# EAGLE design Laser head board (EAGLE 9.6.2)
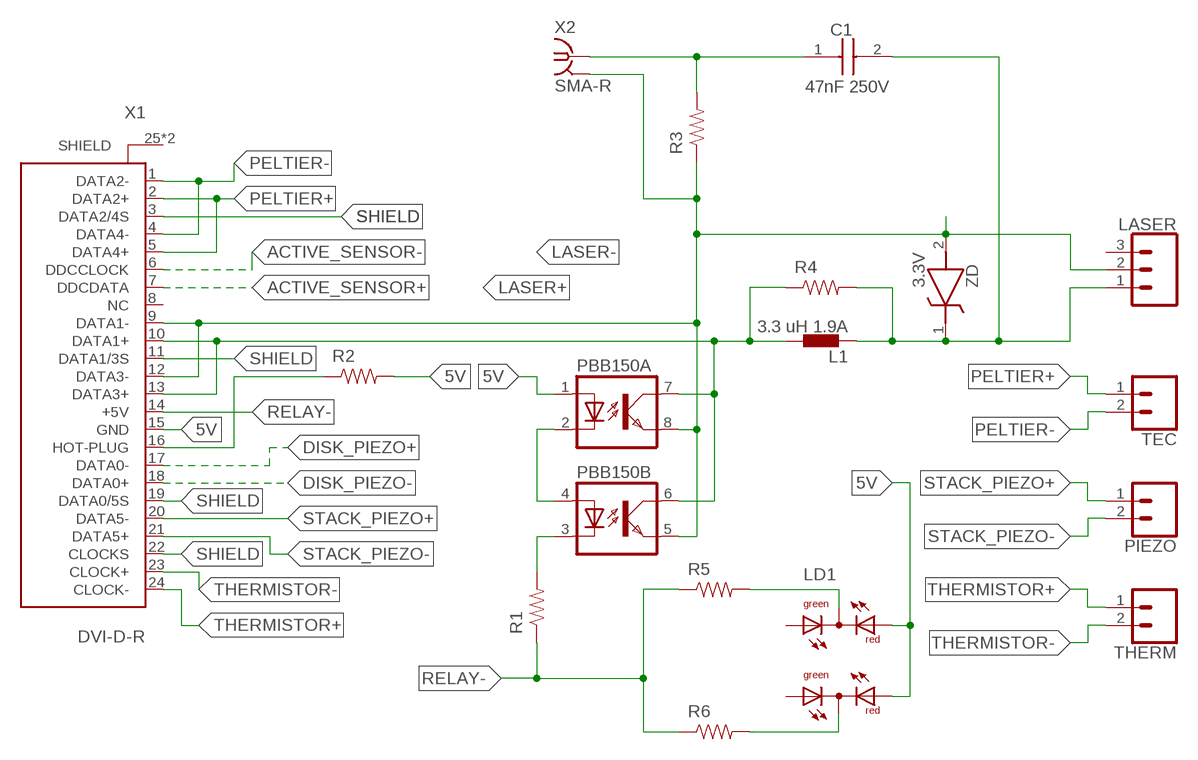
[diagram p0: schematic, sheet 1]

## Parts
C1  47nF 250V  OCR_C3216X7R2E473K160AA  [OCR_CAPC3216X180N]
L1  3.3 uH 1.9A  OCR_SLF7032T  [OCR_INDC7070]
LASER  OCR_CONN_03  [OCR_MOLEX-1X3_LOCK]
LD1  OCR_WP130WCP/2EGW  [OCR_WP130WCP/2EGW]
PBB150  OCR_PBB150  [OCR_DIL08]
PIEZO  OCR_CONN_02  [OCR_MOLEX-1X2_LOCK]
R1  390R  OCR_RESISTOR  [OCR_0805]
R2  4k99  OCR_RESISTOR  [OCR_0805]
R3  10k  OCR_RESISTOR  [OCR_0805]
R4  43R  OCR_RESISTOR  [OCR_0805]
R5  499R  OCR_RESISTOR  [OCR_0805]
R6  499R  OCR_RESISTOR  [OCR_0805]
TEC  OCR_CONN_02  [OCR_MOLEX-1X2_LOCK]
THERM  OCR_CONN_02  [OCR_MOLEX-1X2_LOCK]
X1  DVI-D-R  OCR_DVI-D-R_74320  [OCR_DVI-D-R]
X2  SMA-R  OCR_SMA-R/A  [OCR_SMA_0732512201]
ZD  3.3V  OCR_MMSZ3V3T1G  [OCR_SOD3716X135N]

## Nets
5V: LD1.R1 LD1.R2 PBB150.1(A:A) R2.2 X1.15(GND)
ACTIVE_SENSOR+: X1.7(DDCDATA)
ACTIVE_SENSOR-: X1.6(DDCCLOCK)
DISK_PIEZO+: X1.17(DATA0-)
DISK_PIEZO-: X1.18(DATA0+)
INTERLOCK+: R2.1 X1.16(HOT-PLUG)
LASER+: L1.2 PBB150.6(B:COL) PBB150.7(A:COL) R4.1 X1.10(DATA1+) X1.13(DATA3+)
LASER-: LASER.2 PBB150.5(B:EMIT) PBB150.8(A:EMIT) R3.1 X1.9(DATA1-) X1.12(DATA3-) X2.2 X2.3 X2.4 X2.5 ZD.2(A)
N$1: LD1.GND1 R5.2
N$2: C1.1 R3.2 X2.1
N$3: LD1.GND2 R6.2
N$7: PBB150.2(A:C) PBB150.4(B:A)
N$8: PBB150.3(B:C) R1.2
N$10: C1.2 L1.1 LASER.1 R4.2 ZD.1(K)
PELTIER+: TEC.1 X1.2(DATA2+) X1.5(DATA4+)
PELTIER-: TEC.2 X1.1(DATA2-) X1.4(DATA4-)
RELAY-: R1.1 R5.1 R6.1 X1.14(+5V)
SHIELD: X1.3(DATA2/4S) X1.11(DATA1/3S) X1.19(DATA0/5S) X1.22(CLOCKS)
STACK_PIEZO+: PIEZO.1 X1.20(DATA5-)
STACK_PIEZO-: PIEZO.2 X1.21(DATA5+)
THERMISTOR+: THERM.1 X1.24(CLOCK-)
THERMISTOR-: THERM.2 X1.23(CLOCK+)
Unconnected: LASER.3 LD1.G1 LD1.G2 X1.8(NC)

## Power pins joined to a net without a drawn wire
SHIELD: X1.25(SHIELD) X1.26(SHIELD)

## Library data of the parts
C1 = headboard:OCR_C3216X7R2E473K160AA: TDK C3216 C 47nF Ceramic Multilayer Capacitor, 250 V dc, +125C, X7R Dielectric, 10% SMD Source: Datasheet <https://componentsearchengine.com/Datasheets/1/C3216X7R2E473K160AA.pdf>; DESCRIPTION: TDK C3216 C 47nF Ceramic Multilayer Capacitor, 250 V dc, +125C, X7R Dielectric, 10% SMD; HEIGHT: 1.8mm; MANUFACTURER_NAME: TDK; MANUFACTURER_PART_NUMBER: C3216X7R2E473K160AA; MOUSER_PART_NUMBER: 810-C3216X7R2E473K
L1 = headboard:OCR_SLF7032T: Fixed Inductors 100uH 0.6A; AVAILABILITY: Good; DESCRIPTION: Inductor Power Shielded Wirewound 100uH 20% 100KHz Ferrite 650mA 300mOhm DCR T/R; MF: TDK; MP: SLF7045T-101MR50-PF; PACKAGE: Nonstandard TDK; PRICE: 0.56 USD
LASER = headboard:OCR_CONN_03: Multi connection point. Often used as Generic Header-pin footprint for 0.1 inch spaced/style header connections On any of the 0.1 inch spaced packages, you can populate with these: Break Away Headers - Straight <https://www.sparkfun.com/products/116> (PRT-00116) Break Away Male Headers - Right Angle <https://www.sparkfun.com/products/553> (PRT-00553) Female Headers <https://www.sparkfun.com/products/115> (PRT-00115) Break Away Headers - Machine Pin <https://www.sparkfun.com/products/117> (PRT-00117) Break Away Female Headers - Swiss Machine Pin <https://www.sparkfun.com/products/743> (PRT-00743) Stackable Header - 3 Pin (Female, 0.1") <https://www.sparkfun.com/products/13875> (PRT-13875) For SCREWTERMINALS and SPRING TERMINALS visit here: Screw Terimnals on SparkFun.com <https://www.sparkfun.com/search/results?term=Screw+Terminals> (5mm/3.5mm/2.54mm spacing) This device is also useful as a general connection point to wire up your design to another part of your project. Our various solder wires solder well into these plated through hole pads. Hook-Up Wire - Assortment (Stranded, 22 AWG) <https://www.sparkfun.com/products/11375> (PRT-11375) Hook-Up Wire - Assortment (Solid Core, 22 AWG) <https://www.sparkfun.com/products/11367> (PRT-11367) View the entire wire category on our website here <https://www.sparkfun.com/categories/141> Special notes: Molex polarized connector foot print use with SKU : PRT-08232 with associated crimp pins and housings.
LD1 = headboard:OCR_WP130WCP/2EGW: Kingbright LED Two LED, 2 colors (red/green), 5 mm, round, common Cathode
PBB150 = headboard:OCR_PBB150: Mfr: IXYS Integrated Circuits Mouser <https://www.mouser.mx/ProductDetail/IXYS-Integrated-Circuits/PBB150?qs=sGAEpiMZZMsUriz2CNI3E0bxyj4gwKaXLjsKBQE3348=> Digikey <https://www.digikey.com.mx/product-detail/es/ixys-integrated-circuits-division/PBB150/CLA191-ND/565936>
PIEZO TEC THERM = headboard:OCR_CONN_02: Multi connection point. Often used as Generic Header-pin footprint for 0.1 inch spaced/style header connections On any of the 0.1 inch spaced packages, you can populate with these: Break Away Headers - Straight <https://www.sparkfun.com/products/116> (PRT-00116) Break Away Male Headers - Right Angle <https://www.sparkfun.com/products/553> (PRT-00553) Female Headers <https://www.sparkfun.com/products/115> (PRT-00115) Break Away Headers - Machine Pin <https://www.sparkfun.com/products/117> (PRT-00117) Break Away Female Headers - Swiss Machine Pin <https://www.sparkfun.com/products/743> (PRT-00743) For SCREWTERMINALS and SPRING TERMINALS visit here: Screw Terimnals on SparkFun.com <https://www.sparkfun.com/search/results?term=Screw+Terminals> (5mm/3.5mm/2.54mm spacing) This device is also useful as a general connection point to wire up your design to another part of your project. Our various solder wires solder well into these plated through hole pads. Hook-Up Wire - Assortment (Stranded, 22 AWG) <https://www.sparkfun.com/products/11375> (PRT-11375) Hook-Up Wire - Assortment (Solid Core, 22 AWG) <https://www.sparkfun.com/products/11367> (PRT-11367) View the entire wire category on our website here <https://www.sparkfun.com/categories/141> Special notes: Molex polarized connector foot print use with: PRT-08233 with associated crimp pins and housings. 2.54_SCREWTERM for use with PRT-10571. 3.5mm Screw Terminal footprints for PRT-08084 5mm Screw Terminal footprints for use with PRT-08432
R1-R6 = headboard:OCR_RESISTOR: 0.75Ω resistor A resistor is a passive two-terminal electrical component that implements electrical resistance as a circuit element. Resistors act to reduce current flow, and, at the same time, act to lower voltage levels within circuits. - Wikipedia
X1 = headboard:OCR_DVI-D-R: 74320-9004 MiroCross(TM)-DVI i/0 plug and receptacle connector system (scart)
X2 = headboard:OCR_SMA-R/A: SMA CONNECTOR JACK R/A 50 OHM PCB Molex, LLC.
ZD = headboard:OCR_MMSZ3V3T1G: 500 mW 3.3 V 5% ZenerDiodeVoltage Regulator Source: Datasheet <https://componentsearchengine.com/Datasheets/1/MMSZ3V3T1G.pdf>; DESCRIPTION: 500 mW 3.3 V 5% ZenerDiodeVoltage Regulator; HEIGHT: 1.35mm; MANUFACTURER_NAME: ON Semiconductor; MANUFACTURER_PART_NUMBER: MMSZ3V3T1G; MOUSER_PART_NUMBER: 863-MMSZ3V3T1G

## Net classes
0 default: clearance 0.152 mm

## Board
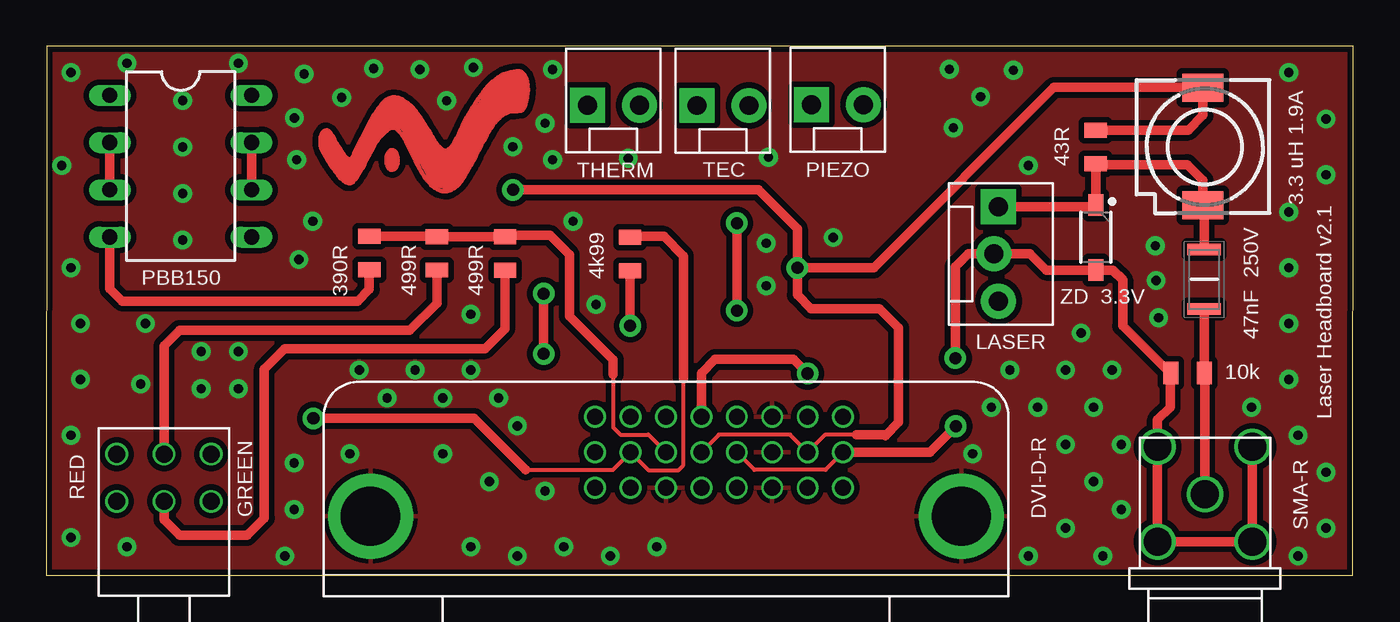
[diagram p1: board, top side]
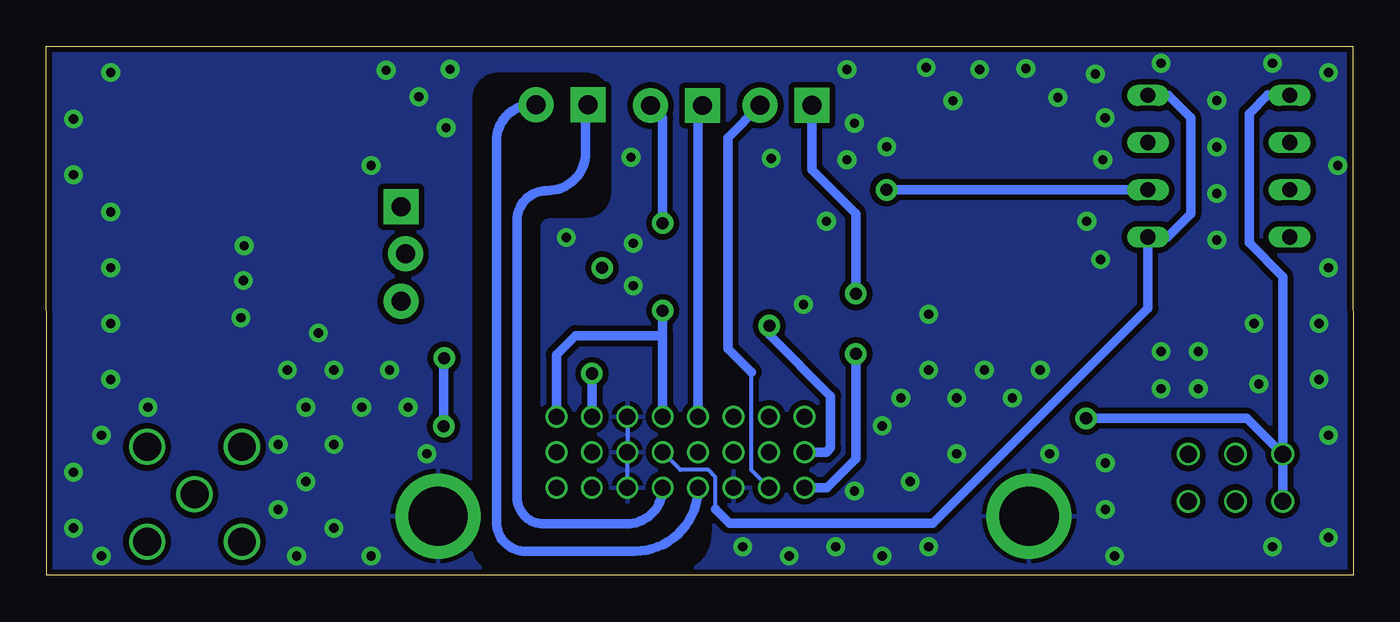
[diagram p2: board, bottom side, seen from below]

Size 70.28 x 28.42 mm. Coordinates in mm from the lower left corner, seen from the top.
Outline: 0,0 70.28,0 70.28,28.42 0,28.42 0,0
Copper layers (1*16): Top 0.035mm / dielectric 1.5mm / Bottom 0.035mm
Design rules "ECDL OCR DRC": minimum track width 6mil, minimum drill 0.5mm, track to track 8mil, track to pad 8mil, pad to pad 8mil, via to via 8mil, smd to smd 8mil, copper to edge 8mil, drill to drill 8mil, minimum pad ring 6mil, minimum via ring 10mil, stop-mask expansion 4mil, vias tented up to drill 20mil, thermal gap 10mil

### Footprints (pad centres in the part's own frame; a part is rotated, then mirrored left to right if it is on the bottom)
OCR_CAPC3216X180N = smd 0.62 x 1.82: 1 -1.6,0; 2 1.6,0
OCR_INDC7070 = smd 1.5 x 2.2: 1 -3.15,0; 2 3.15,0
OCR_MOLEX-1X3_LOCK = drill 1.016 pad 1.88 square: 1 0,0.127 | drill 1.016 pad 1.88: 2 2.54,-0.127; 3 5.08,0.127
OCR_WP130WCP/2EGW = drill 0.914: G1 2.54,1.27; G2 2.54,-1.27; GND1 0,1.27; GND2 0,-1.27; R1 -2.54,1.27; R2 -2.54,-1.27
OCR_DIL08 = drill 0.813 long: 1 -3.81,-3.81; 2 -1.27,-3.81; 3 3.81,-3.81; 4 1.27,-3.81; 5 3.81,3.81; 6 1.27,3.81; 7 -1.27,3.81; 8 -3.81,3.81
OCR_MOLEX-1X2_LOCK = drill 1.016 pad 1.88 square: 1 -0.127,0 | drill 1.016 pad 1.88: 2 2.667,0
OCR_0805 = smd 0.8 x 1.2: 1 -0.9,0; 2 0.9,0
OCR_DVI-D-R = drill 0.864 pad 1.016: 1 -9.525,6.985; 2 -7.62,6.985; 3 -5.715,6.985; 4 -3.81,6.985; 5 -1.905,6.985; 6 0,6.985; 7 1.905,6.985; 8 3.81,6.985; 9 -9.525,5.08; 10 -7.62,5.08; 11 -5.715,5.08; 12 -3.81,5.08; 13 -1.905,5.08; 14 0,5.08; 15 1.905,5.08; 16 3.81,5.08; 17 -9.525,3.175; 18 -7.62,3.175; 19 -5.715,3.175; 20 -3.81,3.175; 21 -1.905,3.175; 22 0,3.175; 23 1.905,3.175; 24 3.81,3.175 | drill 3.175 pad 4.572: 25 -15.9,1.651; 26 15.9,1.651
OCR_SMA_0732512201 = drill 1.499: 1 0,0; 2 2.55,2.55; 3 2.55,-2.55; 4 -2.55,-2.55; 5 -2.55,2.55
OCR_SOD3716X135N = smd 1.15 x 0.8: 1 -1.75,0; 2 1.75,0

### Placement (x,y rotation side)
C1  62.27,15.9 90 top
L1  62.21,23.04 90 top
LASER  51.09,19.81 270 top
LD1  6.32,5.23 0 top
PBB150  7.22,21.99 270 top
PIEZO  41.29,25.3 0 top
R1  17.36,17.31 270 top
R2  31.39,17.26 90 top
R3  61.38,10.86 0 top
R4  56.44,23.03 270 top
R5  21,17.3 270 top
R6  24.67,17.3 270 top
TEC  35.12,25.25 0 top
THERM  29.22,25.27 0 top
U$2  [LANMAC_2.0_COPPER]  14.72,20.61 0 top
X1  33.32,1.52 0 bottom
X2  62.32,4.35 0 top
ZD  56.45,18.15 270 top

### Tracks (layer width: path | path; a pad name or v marks a point on that pad's centre or on a via)
5V  (via drill 0.65)
  Top 0.203: 25.78,5.65 30.47,5.65 X1.15 32.38,5.64 33.99,5.64 34.27,5.92 34.27,9.61 34.27,10.56
  Top 0.508: v14.36,8.43 23.01,8.43 25.78,5.65 | 34.27,10.56 34.27,17.16 33.21,18.21 31.44,18.21 R2.2
  Bottom 0.508: PBB150.1 4.55,25.8 4.58,25.83 5.59,24.81 5.59,17.86 3.78,16.05 LD1.R1 | v14.36,8.43 5.7,8.43 LD1.R1 | LD1.R1 LD1.R2
INTERLOCK+  (via drill 0.65 pad 1)
  Top 0.508: v31.4,13.41 31.4,16.34 R2.1
  Bottom 0.508: v31.4,13.41 31.4,12.92 28.1,9.62 28.1,6.84 28.34,6.6 X1.16
LASER+  (via drill 0.65)
  Top 0.203: X1.13 36.17,7.55 40,7.55 X1.10 41.87,7.53 43.56,7.53
  Top 0.508: v25.09,20.71 38.31,20.71 40.39,18.63 v40.39,16.52 | v40.39,16.52 44.5,16.52 54.2,26.22 62.18,26.22 L1.2 62.21,24.71 61.42,23.93 R4.1 | v40.39,16.52 40.39,15.07 41.12,14.33 44.8,14.33 45.84,13.3 45.84,8.23 45.12,7.5 45.09,7.53 43.56,7.53 | PBB150.7 PBB150.6
  Bottom 0.508: PBB150.6 v25.09,20.72 v25.09,20.71
LASER-  (via drill 0.65)
  Top 0.203: X1.9 41.9,5.66 38.08,5.66 X1.12
  Top 0.508: X1.9 47.51,6.6 v48.91,8 | v48.89,11.66 48.89,16.58 49.58,17.27 LASER.2 52.91,17.27 53.77,16.4 ZD.2 57.36,16.4 57.89,15.87 57.89,13.4 60.44,10.85 60.44,10.83 | 60.44,10.83 60.44,9.02 59.77,8.34 X2.5 X2.4 X2.3 X2.2 | 60.44,10.83 R3.1
  Bottom 0.203: 34.3,3.55 34.3,5.27 34.68,5.65 36.18,5.65 X1.12
  Bottom 0.508: 34.3,3.55 33.54,2.79 22.6,2.79 11.03,14.36 PBB150.5 9.98,18.18 8.74,19.42 8.74,24.6 9.94,25.8 PBB150.8 | v48.91,8 48.91,11.64 v48.89,11.66
N$1
  Top 0.508: R5.2 21,14.61 19.55,13.15 7.16,13.15 6.32,12.32 LD1.GND1
N$2
  Top 0.508: C1.1 R3.2 62.32,10.83 X2.1
N$3
  Top 0.508: R6.2 24.67,13.26 23.58,12.18 12.81,12.18 11.71,11.08 11.71,3.06 10.79,2.14 7.16,2.14 6.32,2.98 LD1.GND2
N$7
  Top 0.508: PBB150.2 PBB150.4
N$8
  Top 0.508: R1.2 17.36,15.36 16.73,14.73 4.07,14.73 3.41,15.39 PBB150.3
N$10
  Top 0.508: 56.49,22.08 61.36,22.08 62.21,21.23 L1.1 62.27,19.83 C1.2 | 56.49,22.08 R4.2 | 56.49,22.08 56.45,22.04 ZD.1 56.36,19.81 LASER.1
PELTIER+  (via drill 0.65)
  Top 0.508: v40.94,10.84 40.19,11.6 35.97,11.6 35.23,10.85 X1.5
  Bottom 0.508: v40.94,10.84 X1.2 | TEC.1 35.23,25.01 X1.5
PELTIER-  (via drill 0.65)
  Top 0.508: v37.13,14.22 v37.13,18.92
  Bottom 0.508: 37.13,12.88 41.81,12.88 42.85,11.84 X1.1 | 37.13,12.88 v37.13,14.22 | v37.13,14.22 | v37.13,18.92 37.13,24.6 TEC.2 | 37.13,12.88 X1.4
RELAY-
  Top 0.203: 30.48,10.8 30.48,7.94 30.87,7.55 32.38,7.55 X1.14
  Top 0.508: 30.48,10.8 30.48,11.58 28.13,13.92 28.13,17.23 27.1,18.26 24.73,18.26 R6.1 R5.1 20.99,18.21 R1.1
SHIELD  (via drill 0.5)
  Bottom 0.203: X1.19 X1.11 X1.3
  other vias: 1.82,13.52 1.32,16.52 0.82,22.02 1.32,27.02 4.32,27.52 10.32,27.52 7.32,25.52 7.32,23.02 7.32,20.52 7.32,18.02 5.32,13.52 5.07,10.27 1.82,10.52 1.32,7.52 1.32,2.02 4.32,1.52 12.82,1.02 13.32,3.52 13.32,6.02 8.32,12.02 10.32,12.02 8.32,10.02 10.32,10.02 16.82,11.02 19.82,11.02 22.82,11.02 18.32,9.52 21.32,9.52 21.32,6.52 16.32,6.52 13.58,16.97 14.32,19.02 23.82,5.02 24.32,9.52 25.32,8.02 26.82,4.52 22.82,1.52 25.32,1.02 27.82,1.52 30.32,1.02 32.82,1.52 29.57,14.55 28.32,19.02 22.82,14.02 50.25,25.72 52.01,27.15 48.57,27.2 52.82,22.02 66.82,27.02 68.82,24.52 68.82,21.52 66.82,19.52 66.82,16.52 66.82,13.52 66.82,10.52 67.32,7.52 68.82,5.52 68.82,2.52 67.32,1.02 64.82,9.02 57.82,7.02 57.82,3.52 56.82,1.02 52.82,1.02 54.82,2.52 56.32,5.02 54.82,7.02 56.32,9.02 57.32,11.02 54.82,11.02 53.32,9.02 50.82,9.02 49.82,6.52 51.82,11.02 59.65,17.71 59.69,15.83 59.82,13.84 38.71,15.55 38.71,17.84 31.3,22.41 38.84,22.47 48.79,24.06 42.32,18.16 55.65,13.01 13.46,22.34 13.34,24.59 13.86,26.95 15.87,25.68 17.6,27.24 20.08,27.18 21.52,25.51 22.96,27.3 27.22,27.18 26.82,24.3 25.09,23.03 27.22,22.34
  pour Bottom (isolate 0.305): 0,0 0,28.42 70.28,28.42 70.28,0
  pour Top (isolate 0.305): 0,0 0,28.42 70.28,28.42 70.28,0
  cutout Bottom: 47.29,25.65 47.29,1.52 arc-90 46.02,0.25 36.5,0.25 arc-90 34.59,2.16 arc-90 35.53,3.71 36.75,3.76 43.15,3.76 arc90 43.79,4.39 43.79,18.67 arc90 43.15,19.3 41.25,19.3 arc-90 39.98,20.57 39.98,25.65 arc-90 41.25,26.92 46.02,26.92 arc-90
STACK_PIEZO+
  Bottom 0.508: PIEZO.1 41.29,25.17 41.29,22.71 arc90 43.32,20.67 43.37,20.67 arc-90 44.97,19.07 44.97,4.17 arc-90 43.55,2.75 39.08,2.75 arc-90 X1.20
STACK_PIEZO-
  Bottom 0.508: PIEZO.2 44.12,25.3 arc-90 46.08,23.34 46.08,2.84 arc-90 44.52,1.29 38.64,1.29 arc-90 X1.21
THERMISTOR+  (via drill 0.65)
  Top 0.508: v26.74,11.89 v26.74,15.14
  Bottom 0.508: v26.74,15.14 26.74,19.43 29.1,21.79 THERM.1 | v26.74,11.89 26.74,6.27 28.31,4.7 X1.24
THERMISTOR-
  Bottom 0.203: 32.37,10.91 32.37,5.65 X1.23
  Bottom 0.508: 32.37,10.91 33.63,12.17 33.63,23.53 THERM.2

### Text on the board
tPlace: 43R | 4k99 | 390R | 499R | 499R | 47nF 250V | ZD 3.3V | 10k | Laser Headboard v2.1 | RED | GREEN